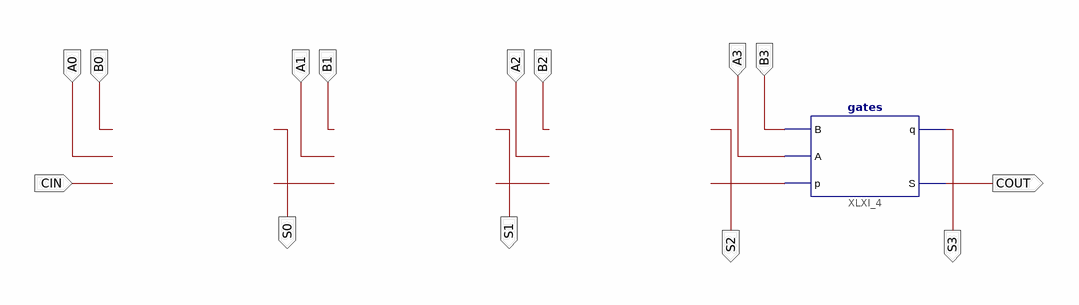
[diagram p0: schematic sheet 1]
// Xilinx ISE schematic fourbits - Copy.sch (spartan3e) as structural Verilog: 1 symbols, 14 ports
module \fourbits_-_Copy  (
  input  CIN,
  input  A0,
  input  B0,
  input  A1,
  input  B1,
  input  A2,
  input  B2,
  input  A3,
  input  B3,
  output S0,
  output COUT,
  output S1,
  output S3,
  output S2
);

  wire XLXN_3;

  gates XLXI_4 (.B(B3), .A(A3), .p(XLXN_3), .q(S3), .S(COUT));
endmodule
